# EAGLE design Urduino328 v1 (EAGLE 5.11)
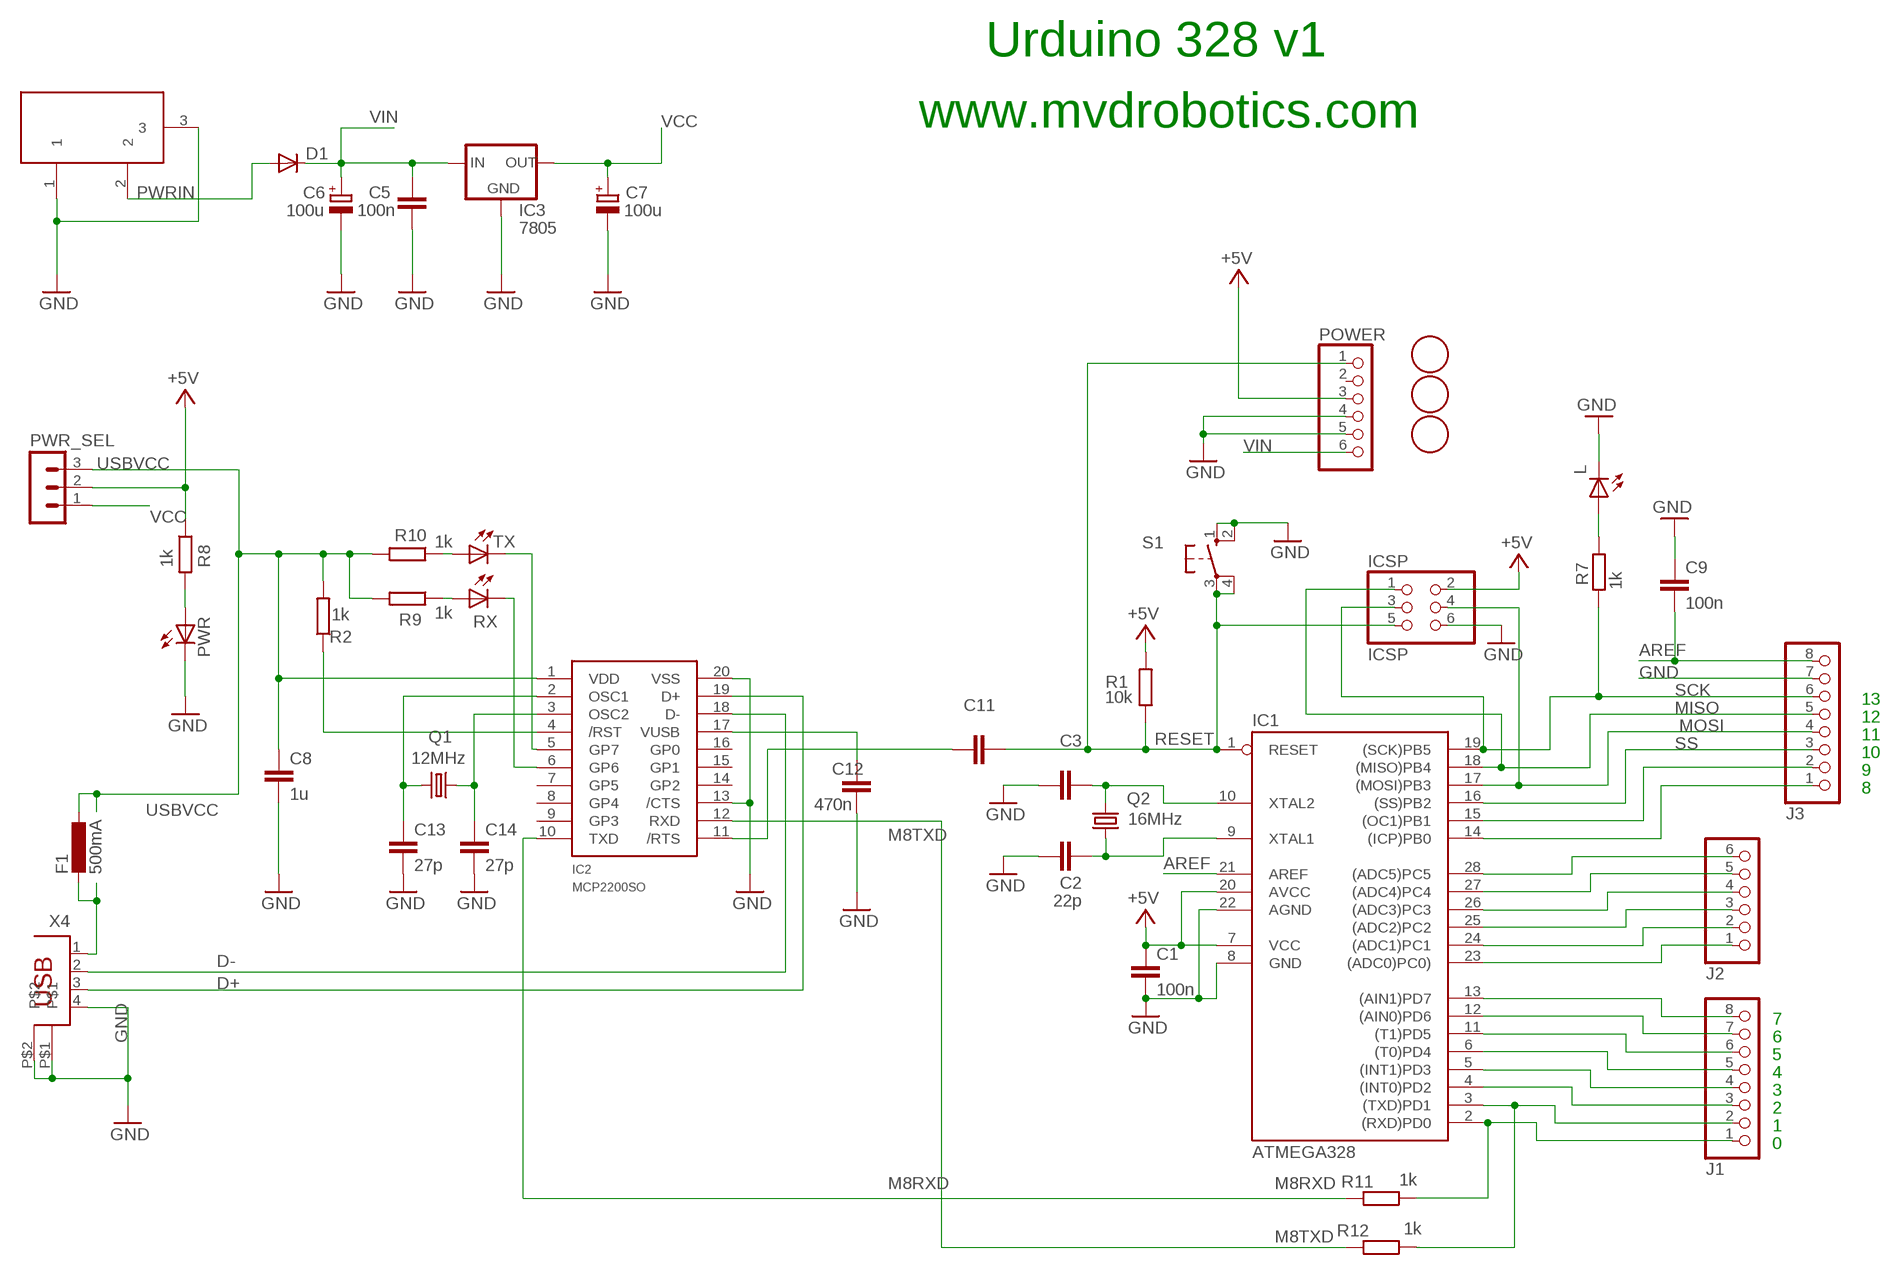
[diagram p0: schematic, sheet 1]

## Parts
C1  100n  C-EU025-024X044  [C025-024X044]
C2  22p  C-EU025-024X044  [C025-024X044]
C3  22p  C-EU025-024X044  [C025-024X044]
C5  100n  C-EU025-024X044  [C025-024X044]
C6  100u  CPOL-EUE3.5-8  [E3,5-8]
C7  100u  CPOL-EUE3.5-8  [E3,5-8]
C8  1u  CAPDECOUPLING  [DEC]
C9  100n  C-EU025-024X044  [C025-024X044]
C11  47n  C-EU025-024X044  [C025-024X044]
C12  470n  CAPDECOUPLING  [DEC]
C13  27p  CAPDECOUPLING  [DEC]
C14  27p  CAPDECOUPLING  [DEC]
D1  DIODE-DO34-7  [DO34-7_PALMER]
F1  500mA  L-EUL1812  [L1812]
IC1  ATMEGA328  AT90S4433P  [DIL28-3]
IC2  MCP2200SO  [SOIC20]
IC3  7805  V_REG_78XXSINK  [TO220-IGO]
ICSP  ICSP  PINHD-2X3  [2X03]
J1  PINHD-1X8  [1X08]
J2  PINHD-1X6  [1X06]
J3  PINHD-1X8  [1X08]
L  LED3MM  [LED3MM]
POWER  PINHD-1X6  [1X06]
PWR  LED3MM  [LED3MM]
PWR_SEL  MA03-1  [MA03-1]
Q1  12MHz  CRYTALHC49S  [HC49/S]
Q2  16MHz  CRYTALHC49S  [HC49/S]
R1  10k  R-EU_0204/5  [0204/5]
R2  1k  R-EU_0204/5  [0204/5]
R7  1k  R-EU_0204/5  [0204/5]
R8  1k  R-EU_0204/5  [0204/5]
R9  1k  R-EU_0204/5  [0204/5]
R10  1k  R-EU_0204/5  [0204/5]
R11  1k  R-EU_0204/5  [0204/5]
R12  1k  R-EU_0204/5  [0204/5]
RX  LED3MM  [LED3MM]
S1  10-XX  [B3F-10XX]
TX  LED3MM  [LED3MM]
U$1  FIDUCIALMOUNT  [FIDUCIA-MOUNT]
U$2  FIDUCIALMOUNT  [FIDUCIA-MOUNT]
U$3  FIDUCIALMOUNT  [FIDUCIA-MOUNT]
X2  DC21MMX  [DC-21MM]
X4  PN61729  [PN61729]

## Nets
+5V [usbvcc]: C1.1 IC1.7(VCC) IC1.20(AVCC) ICSP.2 POWER.3 PWR_SEL.2 R1.2 R8.1
AREF [aref]: C9.2 IC1.21(AREF) J3.8
D+: IC2.19(D+) X4.3
D-: IC2.18(D-) X4.2
GND [gnd]: C1.2 C2.1 C3.1 C5.1 C6.- C7.- C8.2 C9.1 C12.2 C13.2 C14.2 IC1.8(GND) IC1.22(AGND) IC2.13(/CTS) IC2.20(VSS) IC3.GND ICSP.6 J3.7 L.K(C) POWER.4 POWER.5 PWR.K(C) S1.1(S) S1.2(S1) X2.1 X2.3 X4.4 X4.P$1 X4.P$2
M8RXD: IC2.10(TXD) R11.2
M8TXD: IC2.12(RXD) R12.2
MISO: IC1.18((MISO)PB4) ICSP.1 J3.5
MOSI: IC1.17((MOSI)PB3) ICSP.4 J3.4
N$1: C13.1 IC2.2(OSC1) Q1.2
N$2: L.A R7.1
N$3: PWR.A R8.2
N$4: C12.1 IC2.17(VUSB)
N$5: IC1.14((ICP)PB0) J3.1
N$6: C2.2 IC1.9(XTAL1) Q2.1
N$7: C3.2 IC1.10(XTAL2) Q2.2
N$8 [usbvcc]: F1.2 X4.1
N$9: C11.1 IC2.11(/RTS)
N$10: IC1.4((INT0)PD2) J1.3
N$11: IC1.5((INT1)PD3) J1.4
N$12: IC1.6((T0)PD4) J1.5
N$13: IC1.11((T1)PD5) J1.6
N$14: IC1.12((AIN0)PD6) J1.7
N$15: IC1.13((AIN1)PD7) J1.8
N$16: IC1.23((ADC0)PC0)) J2.1
N$17: IC1.24((ADC1)PC1) J2.2
N$18: IC1.25((ADC2)PC2) J2.3
N$19: IC1.26((ADC3)PC3) J2.4
N$20: IC1.27((ADC4)PC4) J2.5
N$21: IC1.28((ADC5)PC5) J2.6
N$22: IC1.15((OC1)PB1) J3.2
N$23: IC2.4(/RST) R2.1
N$25: C14.1 IC2.3(OSC2) Q1.1
N$32: IC2.6(GP6) RX.K(C)
N$34: IC2.5(GP7) TX.K(C)
N$35: R9.1 RX.A
N$36: R10.1 TX.A
PD0: IC1.2((RXD)PD0) J1.1 R11.1
PD1: IC1.3((TXD)PD1) J1.2 R12.1
PWRIN [power]: D1.A X2.2
RESET: C11.2 IC1.1(RESET) ICSP.5 POWER.1 R1.1 S1.3(P) S1.4(P1)
SCK: IC1.19((SCK)PB5) ICSP.3 J3.6 R7.2
SS: IC1.16((SS)PB2) J3.3
USBVCC [usbvcc]: C8.1 F1.1 IC2.1(VDD) PWR_SEL.3 R2.2 R9.2 R10.2
VCC [usbvcc]: C7.+ IC3.OUT PWR_SEL.1
VIN [power]: C5.2 C6.+ D1.C IC3.IN POWER.6
Unconnected: IC2.7(GP5) IC2.8(GP4) IC2.9(GP3) IC2.14(GP2) IC2.15(GP1) IC2.16(GP0) POWER.2

## Notes on the sheet
- Urduino 328 v1
- www.mvdrobotics.com
- 13
- 12
- 11
- 10
- 9
- 8
- 7
- 6
- 5
- 4
- 3
- 2
- 1
- 0

## Library data of the parts
C1-C3 C5 C9 C11 = rcl:C-EU: CAPACITOR, European symbol
C6 C7 = rcl:CPOL-EU: POLARIZED CAPACITOR, European symbol
C8 C12-C14 = dp_devices:CAP
D1 = diode:DIODE-: DIODE
F1 = rcl:L-EU: INDUCTOR, European symbol
IC1 = atmel:AT90S4433: MICROCONTROLLER 4 Kbytes FLASH 128 bytes SRAM 256 bytes EEPROM UART 6-channel 10 bit ADC
IC2 = dp_devices:MCP2200
IC3 = SparkFun:V_REG_78XX: Voltage Regulator Standard 7805 5V regulator. IGO (Input Ground Output). Spark Fun Electronics SKU : COM-00107
ICSP = pinhead:PINHD-2X3: PIN HEADER
J1 J3 = pinhead:PINHD-1X8: PIN HEADER
J2 POWER = pinhead:PINHD-1X6: PIN HEADER
L PWR RX TX = led:LED: LED OSRAM: - CHIPLED LG R971, LG N971, LY N971, LG Q971, LY Q971, LO R971, LY R971 LH N974, LH R974 LS Q976, LO Q976, LY Q976 LO Q996 - Hyper CHIPLED LW Q18S LB Q993, LB Q99A, LB R99A - SideLED LS A670, LO A670, LY A670, LG A670, LP A670 LB A673, LV A673, LT A673, LW A673 LH A674 LY A675 LS A676, LA A676, LO A676, LY A676, LW A676 LS A679, LY A679, LG A679 - Hyper Micro SIDELED® LS Y876, LA Y876, LO Y876, LY Y876 LT Y87S - SmartLED LW L88C, LW L88S LB L89C, LB L89S, LG L890 LS L89K, LO L89K, LY L89K LS L896, LA L896, LO L896, LY L896 - TOPLED LS T670, LO T670, LY T670, LG T670, LP T670 LSG T670, LSP T670, LSY T670, LOP T670, LYG T670 LG T671, LOG T671, LSG T671 LB T673, LV T673, LT T673, LW T673 LH T674 LS T676, LA T676, LO T676, LY T676, LB T676, LH T676, LSB T676, LW T676 LB T67C, LV T67C, LT T67C, LS T67K, LO T67K, LY T67K, LW E67C LS E67B, LA E67B, LO E67B, LY E67B, LB E67C, LV E67C, LT E67C LW T67C LS T679, LY T679, LG T679 LS T770, LO T770, LY T770, LG T770, LP T770 LB T773, LV T773, LT T773, LW T773 LH T774 LS E675, LA E675, LY E675, LS T675 LS T776, LA T776, LO T776, LY T776, LB T776 LHGB T686 LT T68C, LB T68C - Hyper Mini TOPLED® LB M676 - Mini TOPLED Santana® LG M470 LS M47K, LO M47K, LY M47K Source: http://www.osram.convergy.de/
PWR_SEL = con-lstb:MA03-1: PIN HEADER
Q1 Q2 = crystal:CRYTAL: CRYSTAL
R1 R2 R7-R12 = rcl:R-EU_: RESISTOR, European symbol
S1 = switch-omron:10-XX: OMRON SWITCH
U$1-U$3 = SmartPrj:FIDUCIALMOUNT
X2 = powersupply:DC21MM
X4 = SmartPrj:PN61729: BERG USB connector

## Net classes
0 default: width 0.254 mm, clearance 0.254 mm
1 power: width 0.61 mm, drill 0.711 mm, clearance 0.33 mm
2 gnd: width 0.305 mm, drill 0.711 mm, clearance 0.254 mm
3 usbvcc: width 0.508 mm, drill 0.61 mm, clearance 0.254 mm
4 aref: width 0.406 mm

## Board
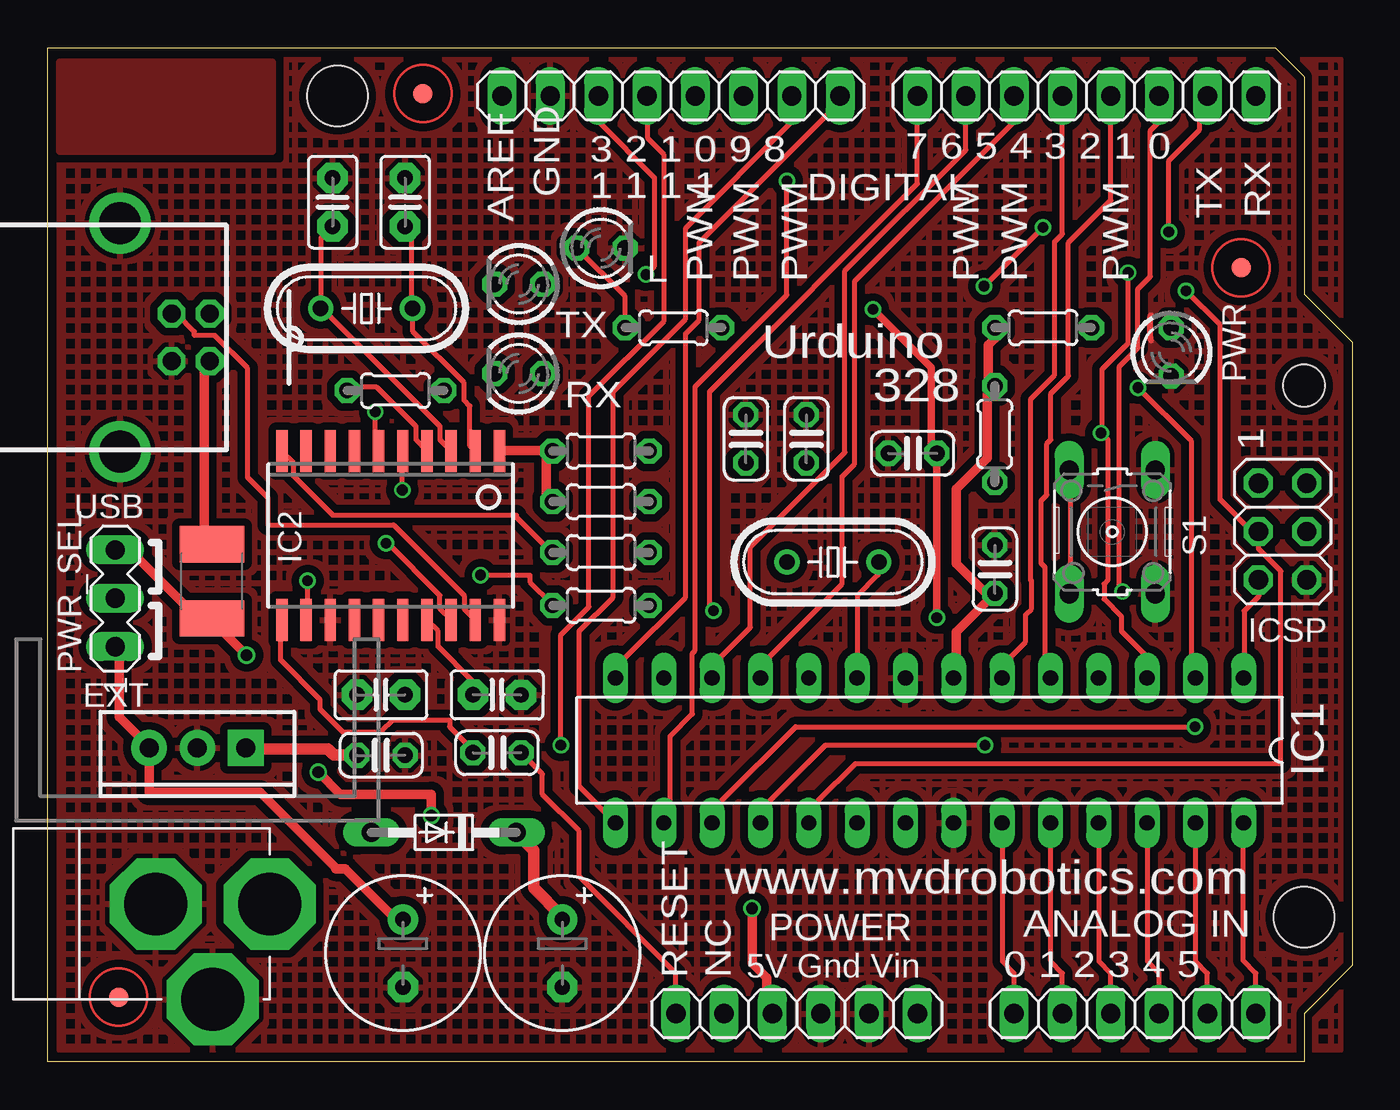
[diagram p1: board, top side]
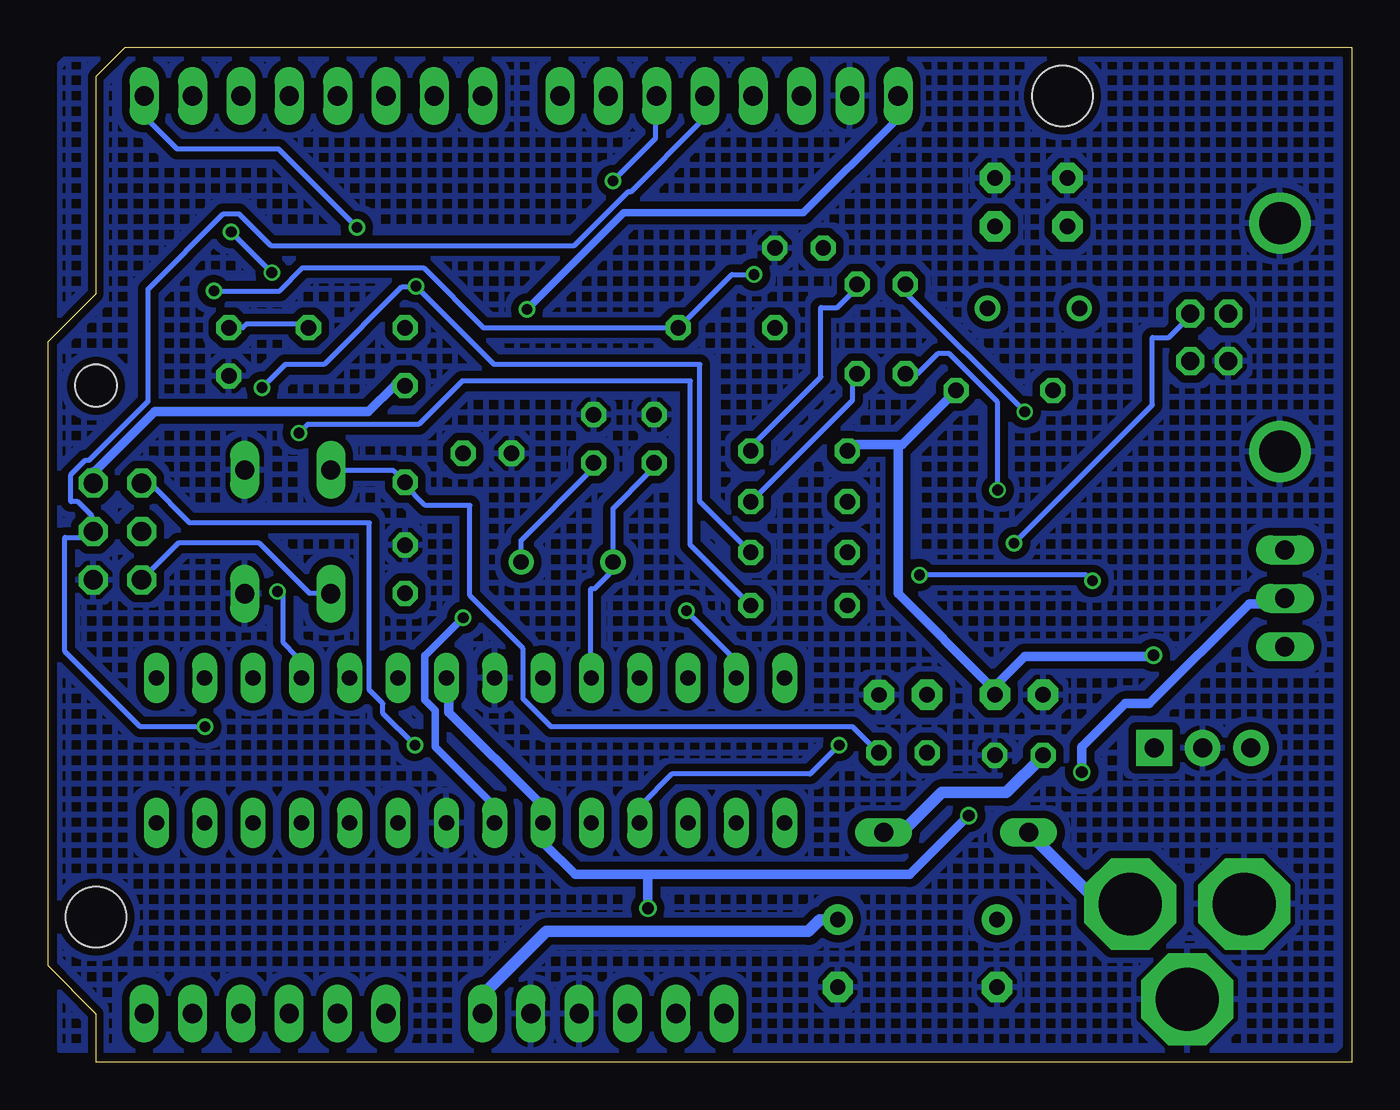
[diagram p2: board, bottom side, seen from below]

Size 68.58 x 53.34 mm. Coordinates in mm from the lower left corner, seen from the top.
Outline: 0,53.34 64.52,53.34 66.04,51.82 66.04,40.39 68.58,37.85 68.58,5.08 66.04,2.54 66.04,0 0,0 0,53.34
Copper layers (1*16): Top 0.035mm / dielectric 1.5mm / Bottom 0.035mm
Design rules "Fusion_eagle_rule_v1.1": minimum track width 6mil, minimum drill 12mil, track to track 6mil, track to pad 6mil, pad to pad 6mil, via to via 6mil, smd to smd 0mil, copper to edge 10mil, drill to drill 10mil, minimum pad ring 10mil, minimum via ring 6mil, stop-mask expansion 2mil, vias tented up to drill 100mil, thermal gap 10mil
Holes 2.2 mm at 66.04,35.56
Holes 3.2 mm at 66.04,7.62 15.24,50.8
vRestrict: area 35.6,8.9 to 57.7,10.2; area 58.9,8.9 to 63.2,10.2; area 37.3,36.8 to 47.8,38.9; area 43.2,34.8 to 47.8,36.6

### Footprints (pad centres in the part's own frame; a part is rotated, then mirrored left to right if it is on the bottom)
C025-024X044 = drill 0.813 octagon: 1 -1.27,0; 2 1.27,0
E3,5-8 = drill 0.813 pad 1.6 round: + -1.778,0 | drill 0.813 pad 1.6 octagon: - 1.778,0
DEC = drill 0.813 pad 1.6 octagon: 1 -1.27,0; 2 1.27,0
DO34-7_PALMER = drill 1 long: A 3.81,0; C -3.81,0
L1812 = smd 1.9 x 3.4: 1 -1.95,0; 2 1.95,0
DIL28-3 = drill 0.813 long: 1 -16.51,-3.81; 2 -13.97,-3.81; 3 -11.43,-3.81; 4 -8.89,-3.81; 5 -6.35,-3.81; 6 -3.81,-3.81; 7 -1.27,-3.81; 8 1.27,-3.81; 9 3.81,-3.81; 10 6.35,-3.81; 11 8.89,-3.81; 12 11.43,-3.81; 13 13.97,-3.81; 14 16.51,-3.81; 15 16.51,3.81; 16 13.97,3.81; 17 11.43,3.81; 18 8.89,3.81; 19 6.35,3.81; 20 3.81,3.81; 21 1.27,3.81; 22 -1.27,3.81; 23 -3.81,3.81; 24 -6.35,3.81; 25 -8.89,3.81; 26 -11.43,3.81; 27 -13.97,3.81; 28 -16.51,3.81
SOIC20 = smd 0.6 x 2.2: 1 -5.715,-4.445; 2 -4.445,-4.445; 3 -3.175,-4.445; 4 -1.905,-4.445; 5 -0.635,-4.445; 6 0.635,-4.445; 7 1.905,-4.445; 8 3.175,-4.445; 9 4.445,-4.445; 10 5.715,-4.445; 11 5.715,4.445; 12 4.445,4.445; 13 3.175,4.445; 14 1.905,4.445; 15 0.635,4.445; 16 -0.635,4.445; 17 -1.905,4.445; 18 -3.175,4.445; 19 -4.445,4.445; 20 -5.715,4.445
TO220-IGO = drill 1 pad 1.88 round: GND 0,0; OUT 2.54,0 | drill 1 pad 1.88 square: IN -2.54,0
2X03 = drill 1.016 octagon: 1 -2.54,-1.27; 2 -2.54,1.27; 3 0,-1.27; 4 0,1.27; 5 2.54,-1.27; 6 2.54,1.27
1X08 = drill 1.016 long: 1 -8.89,0; 2 -6.35,0; 3 -3.81,0; 4 -1.27,0; 5 1.27,0; 6 3.81,0; 7 6.35,0; 8 8.89,0
1X06 = drill 1.016 long: 1 -6.35,0; 2 -3.81,0; 3 -1.27,0; 4 1.27,0; 5 3.81,0; 6 6.35,0
LED3MM = drill 0.813 octagon: A -1.27,0; K 1.27,0
MA03-1 = drill 1.016 long: 1 -2.54,0; 2 0,0; 3 2.54,0
HC49/S = drill 0.813 round: 1 -2.413,0; 2 2.413,0
0204/5 = drill 0.813 octagon: 1 -2.54,0; 2 2.54,0
B3F-10XX = drill 1.016 long: 1 -3.251,2.261; 2 3.251,2.261; 3 -3.251,-2.261; 4 3.251,-2.261
FIDUCIA-MOUNT = smd 1.016 x 1.016: P$1 0,0
DC-21MM = drill 3.302 pad 4.826 octagon: 1 -5.08,-3.353; 2 -0.076,-6.35; 3 -0.076,-0.356
PN61729 = drill 0.95 octagon: 1 1.25,4.71; 2 -1.25,4.71; 3 -1.25,2.71; 4 1.25,2.71 | drill 2.2 round: P$1 -6,0; P$2 6,0

### Placement (x,y rotation side)
C1  49.78,25.91 90 top
C2  39.88,32.77 270 top
C3  36.7,32.77 270 top
C5  17.53,16.13 180 top
C6  27.05,5.71 270 top
C7  18.67,5.71 270 top
C8  17.53,19.3 180 top
C9  45.47,32 0 top
C11  23.62,16.26 0 top
C12  23.62,19.3 359.8 top
C13  18.8,45.21 90 top
C14  14.99,45.21 90 top
D1  20.83,12.06 180 top
F1  8.64,25.27 90 top
IC1  46.35,16.38 180 top
IC2  18.03,27.69 180 top
IC3  7.87,16.51 180 top
ICSP  64.91,27.89 270 top
J1  54.61,50.8 180 top
J2  57.15,2.54 0 top
J3  32.77,50.8 180 top
L  29.08,42.8 0 top
POWER  39.37,2.54 0 top
PWR  59.05,37.34 270 top
PWR_SEL  3.56,24.38 90 top
Q1  16.76,39.62 0 top
Q2  41.27,26.29 180 top
R1  49.78,33.02 90 top
R2  18.29,35.31 0 top
R7  32.89,38.61 0 top
R8  52.32,38.61 0 top
R9  29.08,32.13 180 top
R10  29.08,29.46 180 top
R11  29.08,26.8 180 top
R12  29.08,24 180 top
RX  24.77,40.89 180 top
S1  55.96,27.88 270 top
TX  24.77,36.2 180 top
U$1  19.73,50.92 0 top
U$2  62.73,41.76 0 top
U$3  3.73,3.41 0 top
X2  5.33,8.38 90 top
X4  3.81,38.1 270 top

### Tracks (layer width: path | path; a pad name or v marks a point on that pad's centre or on a via)
+5V  (via drill 0.61)
  Top 0.508: R8.1 49.78,38.05 49.43,37.69 49.43,35.92 R1.2 49.63,35.36 49.38,35.1 49.38,31.75 47.75,30.12 47.75,26.21 49.38,24.59 C1.1 47.75,22.61 47.75,20.32 IC1.7 | v14.22,15.24 15.39,14.07 20.17,14.07 v20.17,12.95 | POWER.3 37.8,2.85 37.8,4.42 37.03,5.18 v37.03,8.08
  Bottom 0.508: R1.2 50.34,35.56 51.71,34.19 62.94,34.19 66.09,31.04 66.14,31.04 66.14,30.48 ICSP.2 | IC1.7 47.6,20.17 47.5,20.17 47.5,18.39 42.72,13.61 42.57,13.61 42.57,12.6 IC1.20 42.47,12.34 42.47,11.48 40.84,9.86 37.03,9.86 | PWR_SEL.2 3.86,24.08 5.44,24.08 10.67,18.85 11.94,18.85 14.22,16.56 v14.22,15.24 | v20.17,12.95 23.27,9.86 37.03,9.86 | 37.03,9.86 v37.03,8.08
AREF  (via drill 0.56)
  Top 0.406: v46.74,23.37 C9.2 46.63,32.16 46.63,32.21 46.43,32.41 46.43,36.52 v43.38,39.57
  Bottom 0.406: v46.74,23.37 48.72,21.39 48.77,21.39 48.77,19.05 48.21,18.49 48.21,16.56 45.31,13.66 45.11,13.66 45.11,12.6 IC1.21 | J3.8 23.88,49.48 24.03,49.48 28.85,44.65 38.3,44.65 v43.38,39.57
D+
  Top 0.254: IC2.19 21.89,23.82 21.89,24.54 18.19,28.25 11.58,28.25 11.58,29.67 10.52,30.73 10.52,36.47 8.79,38.2 7.72,38.2 7.72,38.41 6.81,39.32 6.55,39.32 X4.3
D-  (via drill 0.56)
  Top 0.254: v17.78,27.28 17.88,27.28 20.62,24.54 20.62,23.82 IC2.18
  Bottom 0.254: v17.78,27.28 10.52,34.54 10.52,38.1 9.65,38.1 8.53,39.22 8.53,39.32 X4.2
GND
  Top 0.305: 57.99,37.95 57.96,38.1 57.96,39.12 57.99,39.27
  pour Bottom (isolate 0.406, rank 2, hatched): 0.64,52.7 67.69,52.7 67.94,52.45 67.94,0.64 0.89,0.64 0.64,0.89
  pour Top (isolate 0.406, rank 2, hatched): 0.64,52.7 67.94,52.7 67.94,0.64 0.64,0.64
M8RXD
  Top 0.254: IC2.10 12.9,31.55 12.9,30.84 14.99,28.75 24.64,28.75 24.64,28.65 26.52,26.77 R11.2
M8TXD  (via drill 0.56)
  Top 0.254: v13.66,25.3 13.66,23.32 IC2.12 | v22.76,25.6 25.35,25.6 25.35,25.25 26.52,24.08 26.52,24.03 R12.2
  Bottom 0.254: v13.66,25.3 13.97,25.6 v22.76,25.6
MISO  (via drill 0.56)
  Top 0.254: v49.28,16.66 40.89,16.66 37.95,13.72 37.95,13.06 IC1.18 | J3.5 31.55,50.75 31.55,48.56 32.41,47.7 32.41,38.96 28.45,35 28.45,23.93 26.98,22.45 v26.98,16.66
  Bottom 0.254: v49.28,16.66 50.95,18.34 50.95,18.85 51.66,19.56 51.66,28.35 61.11,28.35 63.2,30.43 63.6,30.43 ICSP.1 | v26.98,16.66 28.5,15.14 35.76,15.14 37.44,13.46 37.44,12.6 IC1.18
MOSI  (via drill 0.56)
  Top 0.254: v60.3,17.63 39.32,17.63 35.41,13.72 35.41,13.06 IC1.17
  Bottom 0.254: v60.3,17.63 63.7,17.63 67.67,21.59 67.67,27.58 66.85,27.58 66.55,27.89 66.19,27.89 ICSP.4 66.24,27.99 66.24,28.7 67,29.46 67.36,29.46 67.36,30.89 66.6,31.65 66.4,31.65 63.3,34.75 63.3,40.64 59.33,44.6 58.52,44.6 56.84,42.93 40.89,42.93 38.05,45.77 37.9,45.77 34.24,49.43 34.04,49.43 J3.4
N$1
  Top 0.254: IC2.2 22.2,32.41 22.2,34.49 21.89,34.8 21.89,35.71 19.2,38.41 19.2,39.62 Q1.2 19.15,39.73 19.15,43.59 C13.1
N$2
  Top 0.254: L.A 30.33,40.28 30.33,38.61 R7.1
N$3
  Bottom 0.254: R8.2 55.07,38.81 58.12,38.81 58.32,38.61 PWR.A
N$4
  Top 0.254: IC2.17 20.52,22.66 20.52,21.84 22.35,20.02 C12.1
N$5
  Top 0.254: J3.1 41.66,50.49 34.24,43.08 34.24,39.01 33.53,38.3 33.53,24.43 30.33,21.23 30.33,20.68 IC1.14
N$6
  Top 0.254: IC1.9 42.57,20.22 42.57,24.54 43.64,25.6 43.64,26.21 43.69,26.26 Q2.1
  Bottom 0.254: C2.2 39.88,30.99 40.13,30.99 43.69,27.43 Q2.1
N$7
  Bottom 0.254: IC1.10 40.03,20.22 40.03,24.89 39.83,24.89 38.86,25.86 Q2.2 38.86,29.11 36.98,30.99 36.73,30.99 36.73,31.5 C3.2
N$8
  Top 0.508: X4.1 8.48,36.83 8.23,36.58 8.23,27.64 F1.2
N$9
  Top 0.254: C11.1 22.35,16.41 21.13,17.63 21.13,17.98 18.14,17.98 17.58,17.42 17.58,17.32 15.54,17.32 14.33,18.54 14.33,19.05 12.24,21.13 12.24,23.16 IC2.11
N$10  (via drill 0.56)
  Top 0.254: v56.49,24.74 56.34,24.74 56.34,36.58 57.3,37.54 57.3,40.64 57.96,41.3 57.96,48.97 58.42,49.43 J1.3
  Bottom 0.254: v56.49,24.74 56.19,24.74 56.19,22.05 55.47,21.34 55.27,21.34 55.27,20.22 IC1.4
N$11
  Top 0.254: J1.4 55.88,45.31 53.65,43.08 53.65,36.07 52.73,35.15 52.73,32.72 52.53,32.51 52.53,29.82 52.22,29.52 52.22,26.21 52.43,26.01 52.43,20.47 IC1.5
N$12
  Top 0.254: J1.5 53.34,43.54 52.93,43.13 52.93,36.12 51.66,34.85 51.66,25.35 51.71,25.3 51.71,23.82 51.41,23.52 51.41,22.1 50.65,21.34 50.65,20.68 IC1.6
N$13
  Top 0.254: J1.6 50.8,49.43 42.42,41.05 42.42,31.45 41.76,30.79 41.76,25.15 37.95,21.34 37.95,20.68 IC1.11
N$14
  Top 0.254: J1.7 48.26,47.95 41.91,41.6 41.91,32.05 36.93,27.08 36.93,22.86 35.41,21.34 35.41,20.68 IC1.12
N$15  (via drill 0.56)
  Top 0.254: v35,23.72 34.8,23.93 34.8,35.26 45.72,46.18 J1.8
  Bottom 0.254: v35,23.72 32.61,21.34 32.41,21.34 32.41,20.22 IC1.13
N$16
  Top 0.254: J2.1 50.8,4.67 50.19,5.28 50.19,12.55 IC1.23
N$17
  Top 0.254: J2.2 53.34,4.67 52.73,5.28 52.73,12.55 IC1.24
N$18
  Top 0.254: J2.3 55.88,4.67 55.27,5.28 55.27,12.55 IC1.25
N$19
  Top 0.254: J2.4 58.42,4.67 57.81,5.28 57.81,12.55 IC1.26
N$20
  Top 0.254: J2.5 60.96,4.67 60.35,5.28 60.35,12.55 IC1.27
N$21
  Top 0.254: J2.6 63.5,4.67 62.84,5.33 62.84,12.55 IC1.28
N$22
  Top 0.254: J3.2 39.12,49.43 33.53,43.84 33.53,39.06 29.72,35.26 29.72,24.43 27.94,22.66 27.94,14.48 IC1.15
N$23
  Top 0.254: R2.1 15.75,35.51 17.27,35.51 19.36,33.43 19.36,32.72 IC2.4
N$25
  Top 0.254: IC2.3 20.62,32.72 20.62,33.43 14.43,39.62 Q1.1 14.38,39.73 14.38,43.33 C14.1
N$27
  pour Top: 0.64,52.58 11.81,52.58 11.81,47.88 0.64,47.88
N$32  (via drill 0.56)
  Top 0.254: v17.22,34.19 17.22,32.31 IC2.6
  Bottom 0.254: v17.22,34.19 23.47,40.44 23.47,40.89 RX.K
N$34  (via drill 0.56)
  Top 0.254: v18.64,30.07 18.64,32.11 IC2.5
  Bottom 0.254: v18.64,30.07 18.64,34.7 21.18,37.24 21.79,37.24 22.81,36.22 23.47,36.22 TX.K
N$35
  Bottom 0.254: R9.1 31.6,32.16 31.6,32.61 31.34,32.61 27.94,36.02 27.94,39.67 27.08,39.67 26.06,40.69 26.06,40.89 RX.A
N$36
  Bottom 0.254: R10.1 31.6,29.46 26.26,34.8 26.26,36.17 26.06,36.17 TX.A
PD0  (via drill 0.56)
  Top 0.254: v49.23,40.79 v52.32,43.89 | v57.3,35.46 60.1,32.66 60.1,20.42 IC1.2
  Bottom 0.254: v52.32,43.89 56.44,48.01 61.77,48.01 63.5,49.73 J1.1 | R11.1 34.29,29.46 34.29,36.68 45.11,36.68 v49.23,40.79 49.33,40.74 49.99,40.74 54.05,36.68 56.08,36.68 v57.3,35.46
PD1  (via drill 0.56)
  Top 0.254: IC1.3 57.76,20.22 57.76,21.34 56.44,22.66 56.44,23.42 55.52,24.33 55.52,25.15 55.73,25.35 55.73,32.72 v55.37,33.07 55.42,33.17 55.42,36.42 56.79,37.8 v56.79,41.5 | J1.2 60.55,50.39 60.55,49.02 58.93,47.4 v58.93,43.64
  Bottom 0.254: v55.37,33.07 54.91,33.53 49.07,33.53 46.79,35.81 34.8,35.81 34.8,27.18 R12.1 | v56.79,41.5 v58.93,43.64
PWRIN
  Bottom 0.61: D1.A 17.02,12.04 13.31,8.33 11.68,8.33 X2.2
RESET
  Top 0.254: C11.2 26.01,15.14 26.01,14.07 27.94,12.14 27.94,9.75 33.02,4.67 POWER.1 | IC1.1 62.89,20.22 62.89,23.72 63.65,24.49 63.65,25.35 ICSP.5 | S1.4 53.75,24.64 53.75,31.09 S1.3
  Bottom 0.254: S1.3 53.7,31.09 50.39,31.09 R1.1 49.84,30.38 48.72,29.26 46.38,29.26 46.38,24.54 43.59,21.74 43.59,19.1 42.11,17.63 26.26,17.63 C11.2 | ICSP.5 63.6,25.4 61.72,27.28 57.45,27.28 54.81,24.64 53.75,24.64 S1.4
SCK  (via drill 0.56)
  Top 0.254: v31.45,41.4 31.9,41.86 31.9,46.48 28.96,49.43 J3.6 | IC1.19 40.49,13.06 40.49,13.72 42.47,15.7 64.82,15.7 64.82,25.81 63.65,26.98 63.65,27.89 ICSP.3 63.55,27.64 61.62,29.57 61.62,38.76 v59.84,40.54
  Bottom 0.254: v31.45,41.4 32.61,41.4 35.41,38.61 R7.2 45.67,38.61 48.82,41.76 55.17,41.76 56.39,40.54 v59.84,40.54
SS  (via drill 0.56)
  Top 0.254: v38.86,46.33 38.86,40.34 34.04,35.51 34.04,21.64 33.88,21.49 33.88,18.29 32.72,17.12 32.72,12.9 IC1.16
  Bottom 0.254: v38.86,46.33 36.63,48.56 36.63,50.8 J3.3
USBVCC  (via drill 0.61)
  Top 0.508: PWR_SEL.3 4.78,26.92 4.78,26.47 7.87,23.37 8.64,23.37 F1.1 8.74,23.11 v10.46,21.39 | IC2.1 23.77,32.16 26.52,32.16 R9.2 26.21,31.95 26.21,29.77 26.52,29.46 R10.2
  Bottom 0.508: R2.2 23.67,32.46 23.88,32.46 | 23.88,32.46 26.11,32.46 26.42,32.16 26.52,32.16 R9.2 | 23.88,32.46 23.88,24.64 19.05,19.81 18.8,19.81 C8.1 18.59,19.96 17.22,21.34 10.52,21.34 v10.46,21.39
VCC
  Top 0.508: PWR_SEL.1 3.76,21.64 3.76,18.14 5.33,16.56 IC3.OUT 5.33,14.17 11.18,14.17 15.14,10.21 15.14,10.16 15.65,10.16 18.14,7.67 18.14,7.52 18.64,7.52 C7.+
VIN
  Top 0.61: IC3.IN 10.41,16.46 14.73,16.46 15.04,16.15 16.26,16.15 C5.2 | D1.C 24.64,12.04 25.55,11.12 25.55,9.14 27.03,7.67 27.03,7.52 C6.+
  Bottom 0.61: POWER.6 45.72,3.71 45.52,3.71 42.37,6.86 28.6,6.86 27.99,7.47 27.08,7.47 C6.+ | C5.2 16.26,16.1 18.19,14.17 21.59,14.17 23.67,12.09 24.64,12.09 D1.C

### Text on the board
tNames: 3 2 1 0 9 8 | 7 6 5 4 3 2 1 0 | GND | 1 1 1 1 | DIGITAL | AREF | TX | RX | PWM | PWM | PWM | PWM | PWM | PWM | TX | Urduino | 328 | RX | 1 | USB | EXT | www.mvdrobotics.com | ANALOG IN | RESET | NC | 5V Gnd Vin | 0 1 2 3 4 5
tValues: 7805
tStop: MADE IN | URUGUAY
Reference: X2